# EasyEDA schematic attiny13ReobasNew_2021-02-27.json
TITLE: Sheet_2; REV: 1.0; Date: 2021-02-14; Sheet: 1/1; Drawn By: shaddyx; Company: Your Company
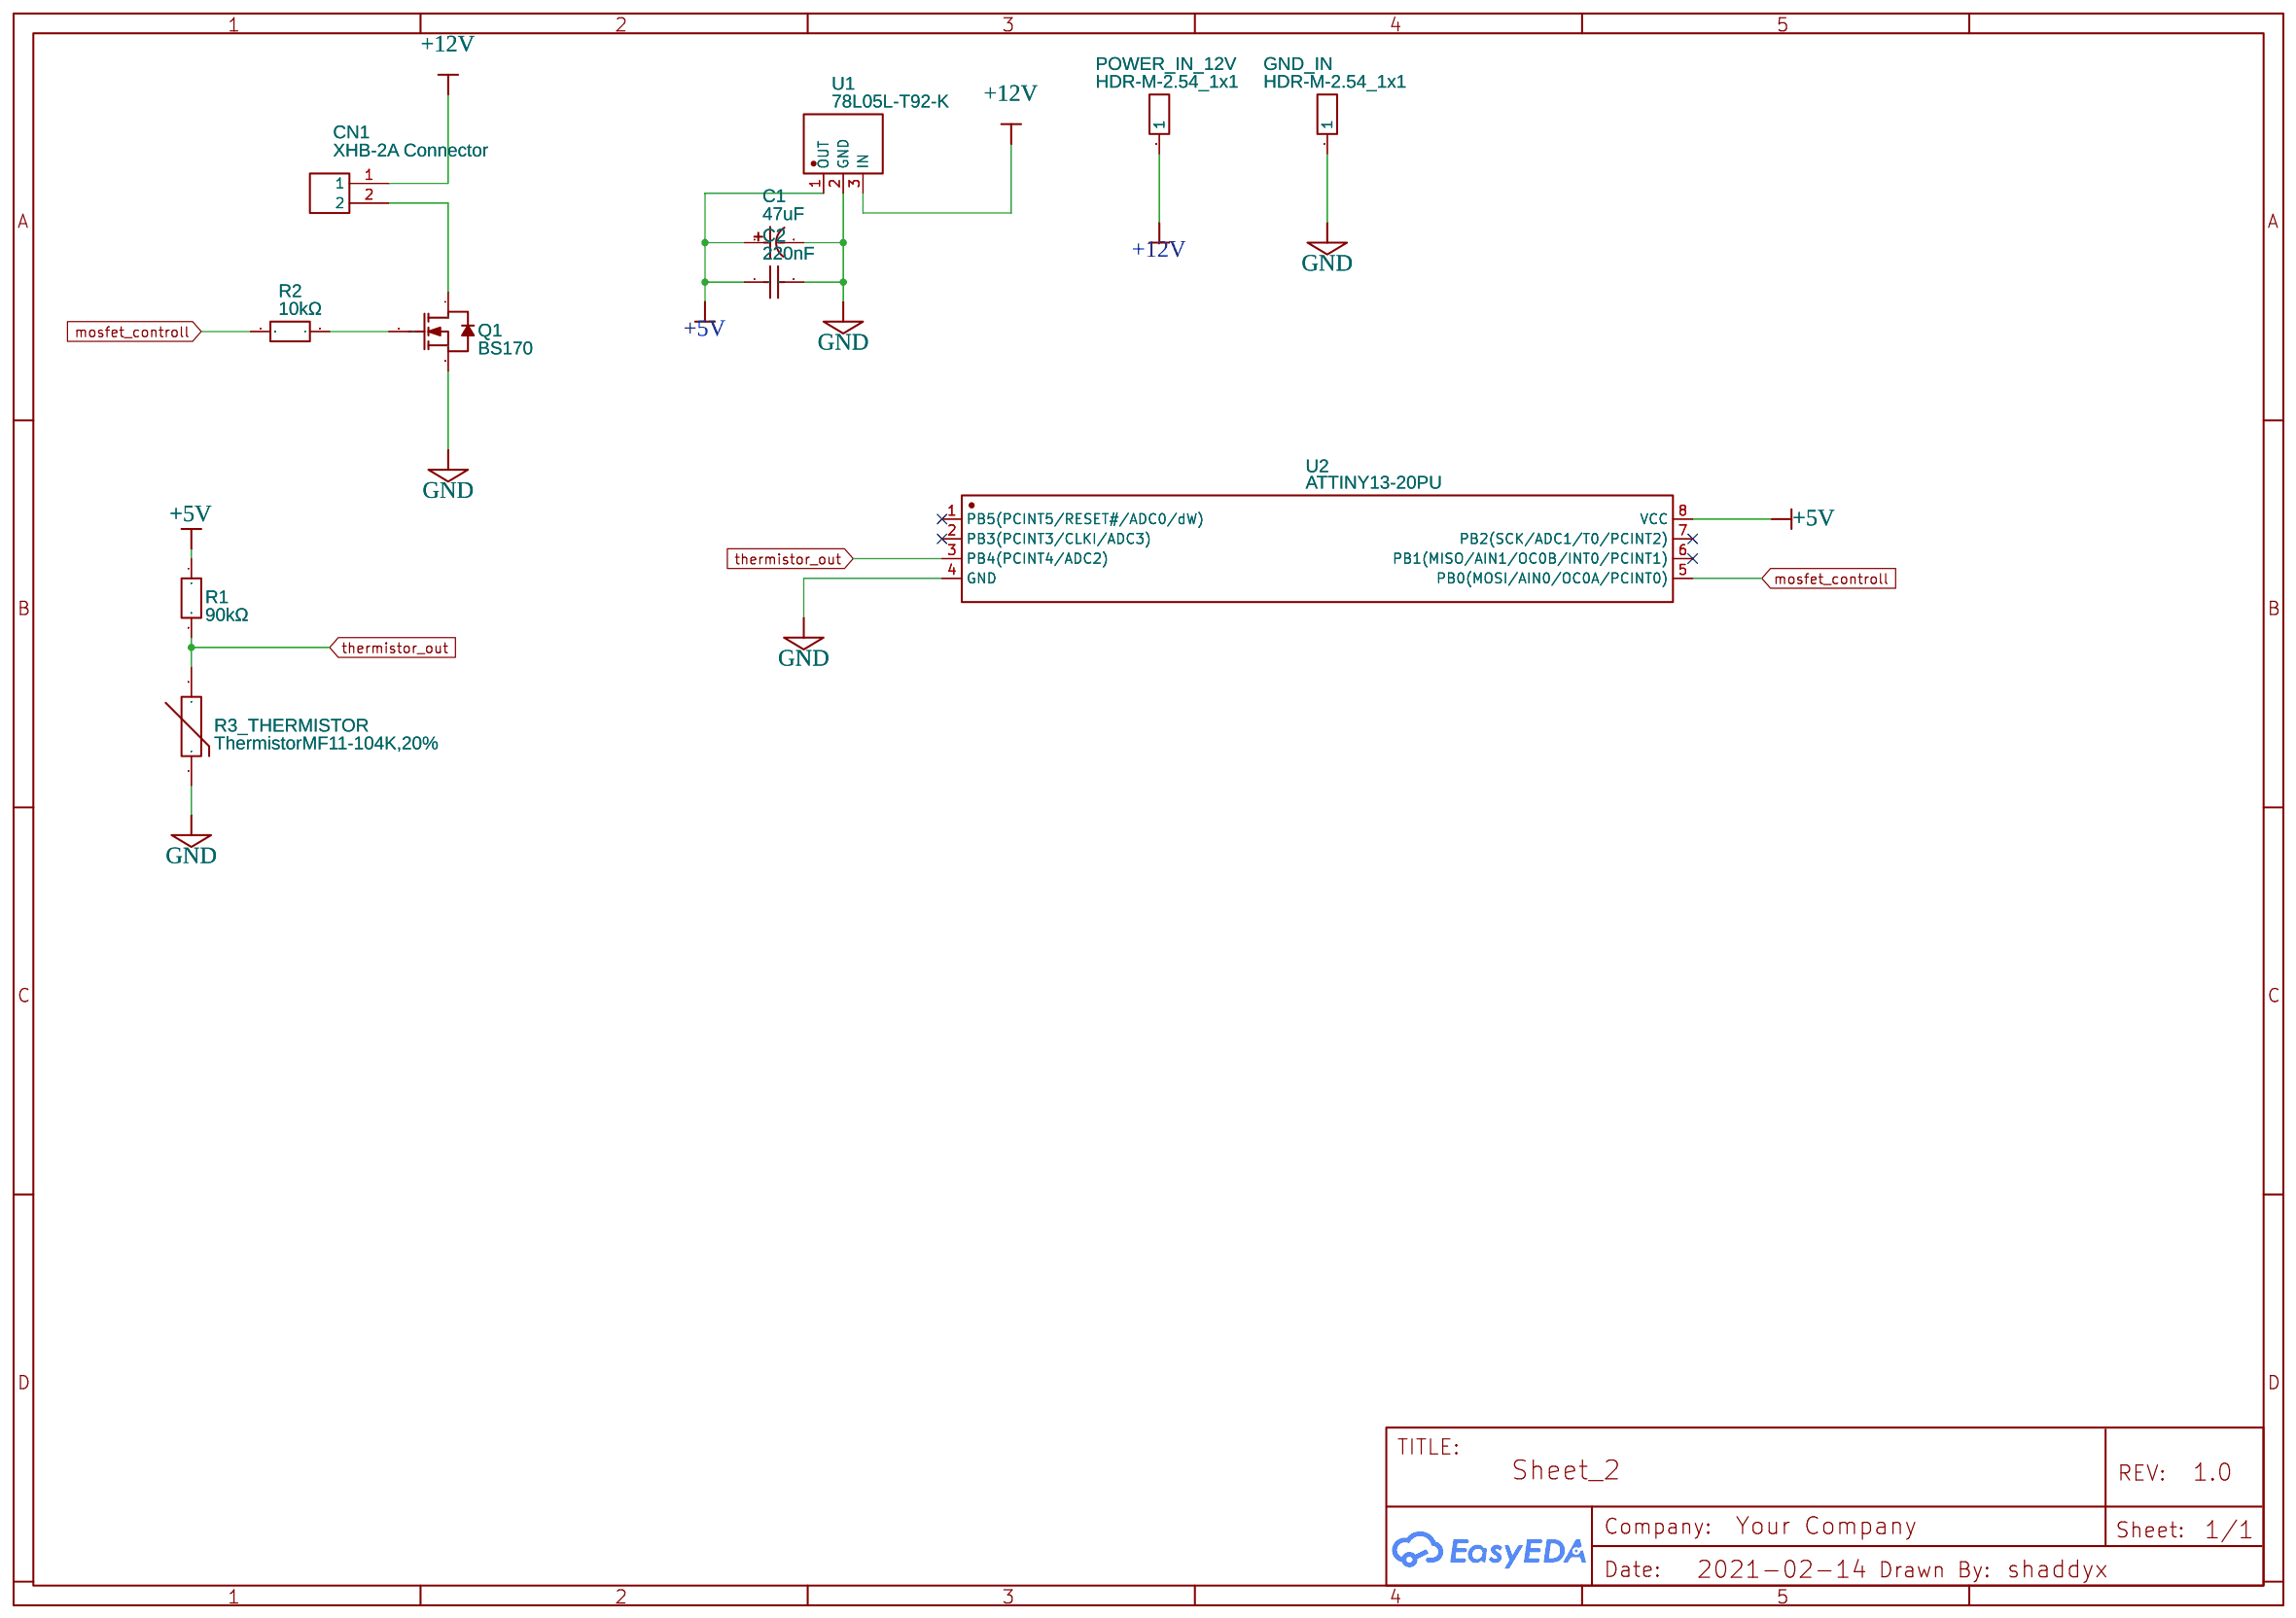
[diagram p0: schematic sheet]

## Parts
C1  47uF  [CAP-TH_BD4.0-P1.50-D0.8-FD]
C2  220nF  [CAP-TH_L4.2-W3.8-P5.08-D0.5]
CN1  XHB-2A Connector  [CONN-TH_XHB-2A]
GND_IN  HDR-M-2.54_1x1  [HDR-M-2.54_1X1]
POWER_IN_12V  HDR-M-2.54_1x1  [HDR-M-2.54_1X1]
Q1  BS170  [TO-92-3_L4.9-W3.7-P1.27-L]
R1  90kΩ  [1/8W RESISTOR]
R2  10kΩ  [1/8W RESISTOR]
R3_THERMISTOR  ThermistorMF11-104K,20%  [RES-TH_L6.5-W4.0-P2.50-D0.5]
U1  78L05L-T92-K  [TO-92-3_L4.9-W3.7-P1.27-L]
U2  ATTINY13-20PU  [DIP-8_L9.2-W6.4-P2.54-LS8.7-BL]

## Library data of the parts
C1 = electrolytic capacitor10UF50V: Supplier: LCSC; Manufacturer: ValuePro; Supplier Part: C32856
C2 = CT4-0805Y224 M500: Supplier: LCSC; Manufacturer: ReliaPro; Supplier Part: C3786
CN1 = XHB-2A Connector: Supplier: LCSC; Manufacturer: BOOMELE; image: //image.lceda.cn/szlcsc/C57981.jpg; Supplier Part: C57981; LCSC Assembly: Yes; SMT Type: Extend
GND_IN POWER_IN_12V = HDR-M-2.54_1x1: Supplier Part: C81276; Supplier: LCSC; Contributor: LCEDA_Lib
Q1 = BS170: Supplier: LCSC; Manufacturer: FAIRCHILD; Supplier Part: C111691; LCSC Assembly: Yes; SMT Type: Extend
R1 = CF1/6W-18KΩ±5%T52: Supplier: LCSC; Supplier Part: C714235; Manufacturer: Huaxing Mechanical-Elec.; Contributor: LCSC
R2 = CF1/6W-18KΩ±5%T52: Supplier: LCSC; Supplier Part: C714235; Manufacturer: Huaxing Mechanical-Elec.; Contributor: LCSC; Package Display: No
R3_THERMISTOR = MF11-104K: Supplier: LCSC; Manufacturer: Shiheng; Supplier Part: C40773
U1 = 78L05L-T92-K: Supplier: LCSC; Supplier Part: C380213; Manufacturer: Unisonic Tech; Contributor: LCSC; LCSC Assembly: Yes; SMT Type: Extend
U2 = ATTINY13-20PU: Supplier: LCSC; Manufacturer: MICROCHIP; Contributor: LCSC; Supplier Part: C145757

## Nets
+5V: C1.1(+) C2.1 R1.1 U1.1(OUT) U2.8(VCC)
+12V: CN1.1 POWER_IN_12V.1 U1.3(IN)
GND: C1.2(-) C2.2 GND_IN.1 Q1.3(S) R3_THERMISTOR.1 U1.2(GND) U2.4(GND)
mosfet_controll: R2.2 U2.5(PB0(MOSI/AIN0/OC0A/PCINT0))
thermistor_out: R1.2 R3_THERMISTOR.2 U2.3(PB4(PCINT4/ADC2))
Net-(CN1-2): CN1.2 Q1.1(D)
Net-(Q1-2): Q1.2(G) R2.1

Not connected (* = marked no-connect by the designer): U2 1(PB5(PCINT5/RESET#/ADC0/dW))* 2(PB3(PCINT3/CLKI/ADC3))* 6(PB1(MISO/AIN1/OC0B/INT0/PCINT1))* 7(PB2(SCK/ADC1/T0/PCINT2))*
